# EAGLE design Power Distribution (EAGLE 6.5.0)
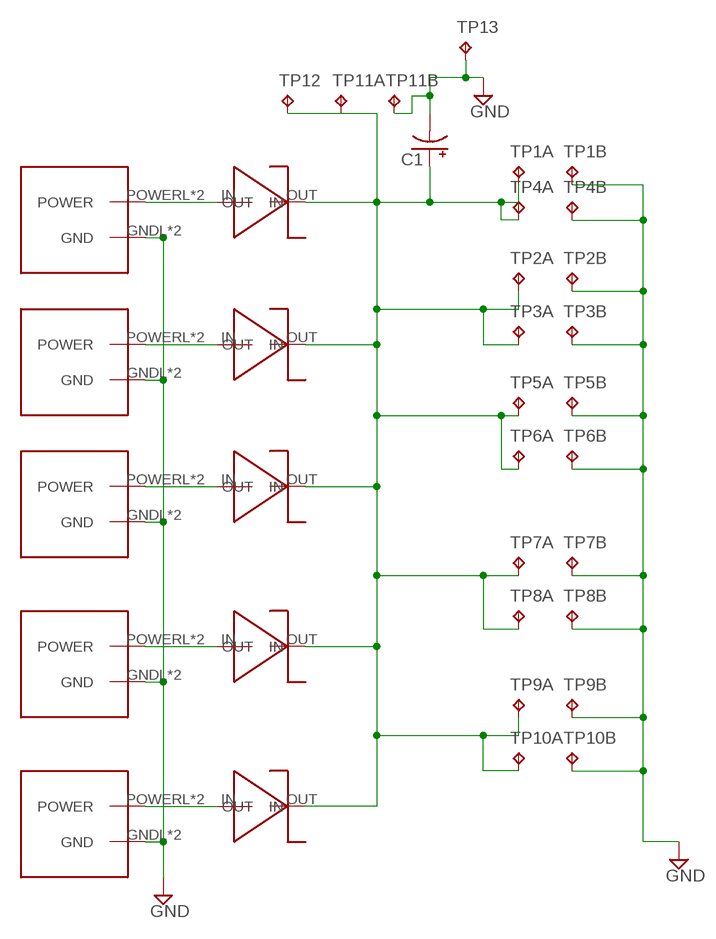
[diagram p0: schematic, sheet 1]

## Parts
C1  CPOL-USE2.5-6  [E2,5-6]
TP1  TP2P2-38-17  [P2-38-17]
TP2  TP2P2-38-17  [P2-38-17]
TP3  TP2P2-38-17  [P2-38-17]
TP4  TP2P2-38-17  [P2-38-17]
TP5  TP2P2-38-17  [P2-38-17]
TP6  TP2P2-38-17  [P2-38-17]
TP7  TP2P2-38-17  [P2-38-17]
TP8  TP2P2-38-17  [P2-38-17]
TP9  TP2P2-38-17  [P2-38-17]
TP10  TP2P2-38-17  [P2-38-17]
TP11  TP2P2-38-17  [P2-38-17]
TP12  TPTP20SQ  [TP20SQ]
TP13  TPTP20SQ  [TP20SQ]
U$1  2X2-MOLEX  [2X2MOLEX]
U$2  2X2-MOLEX  [2X2MOLEX]
U$3  2X2-MOLEX  [2X2MOLEX]
U$4  2X2-MOLEX  [2X2MOLEX]
U$5  2X2-MOLEX  [2X2MOLEX]
U$6  DO-214AB  [DO-214AB]
U$7  DO-214AB  [DO-214AB]
U$8  DO-214AB  [DO-214AB]
U$9  DO-214AB  [DO-214AB]
U$10  DO-214AB  [DO-214AB]

## Nets
GND: C1.- TP1.TP-2 TP2.TP-2 TP3.TP-2 TP4.TP-2 TP5.TP-2 TP6.TP-2 TP7.TP-2 TP8.TP-2 TP9.TP-2 TP10.TP-2 TP11.TP-2 TP13.TP U$1.GNDL(GND) U$1.GNDR(GND) U$2.GNDL(GND) U$2.GNDR(GND) U$3.GNDL(GND) U$3.GNDR(GND) U$4.GNDL(GND) U$4.GNDR(GND) U$5.GNDL(GND) U$5.GNDR(GND)
N$1: U$5.POWERL(POWER) U$5.POWERR(POWER) U$6.IN
N$2: U$1.POWERL(POWER) U$1.POWERR(POWER) U$7.IN
N$3: U$2.POWERL(POWER) U$2.POWERR(POWER) U$8.IN
N$4: U$3.POWERL(POWER) U$3.POWERR(POWER) U$9.IN
N$5: U$4.POWERL(POWER) U$4.POWERR(POWER) U$10.IN
N$6: C1.+ TP1.TP-1 TP2.TP-1 TP3.TP-1 TP4.TP-1 TP5.TP-1 TP6.TP-1 TP7.TP-1 TP8.TP-1 TP9.TP-1 TP10.TP-1 TP11.TP-1 TP12.TP U$6.OUT U$7.OUT U$8.OUT U$9.OUT U$10.OUT

## Library data of the parts
C1 = resistor:CPOL-US: POLARIZED CAPACITOR, American symbol
TP1-TP11 = testpad:TP2: Test pad
TP12 TP13 = testpad:TP: Test pad
U$1-U$5 = Molex:2X2-MOLEX
U$6-U$10 = Diodes:DO-214AB

## Board
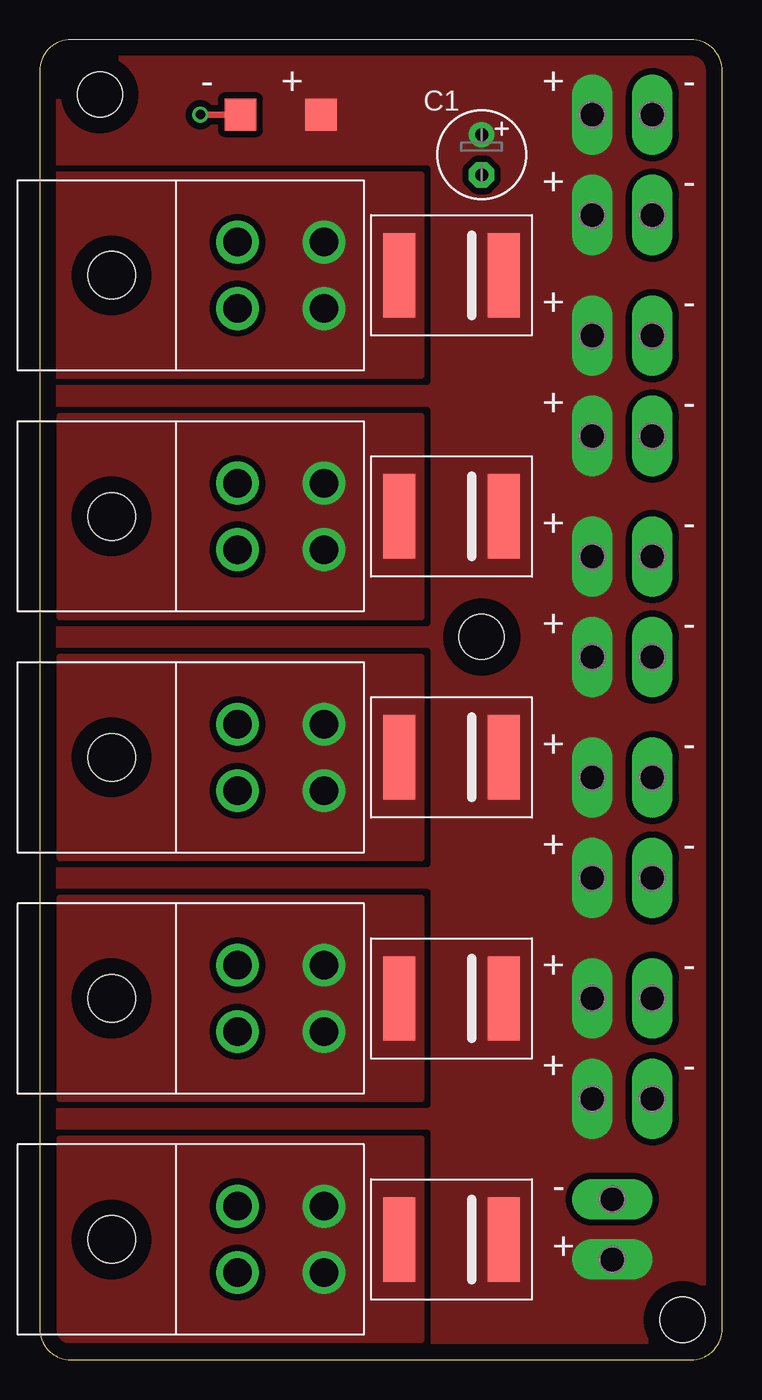
[diagram p1: board, top side]
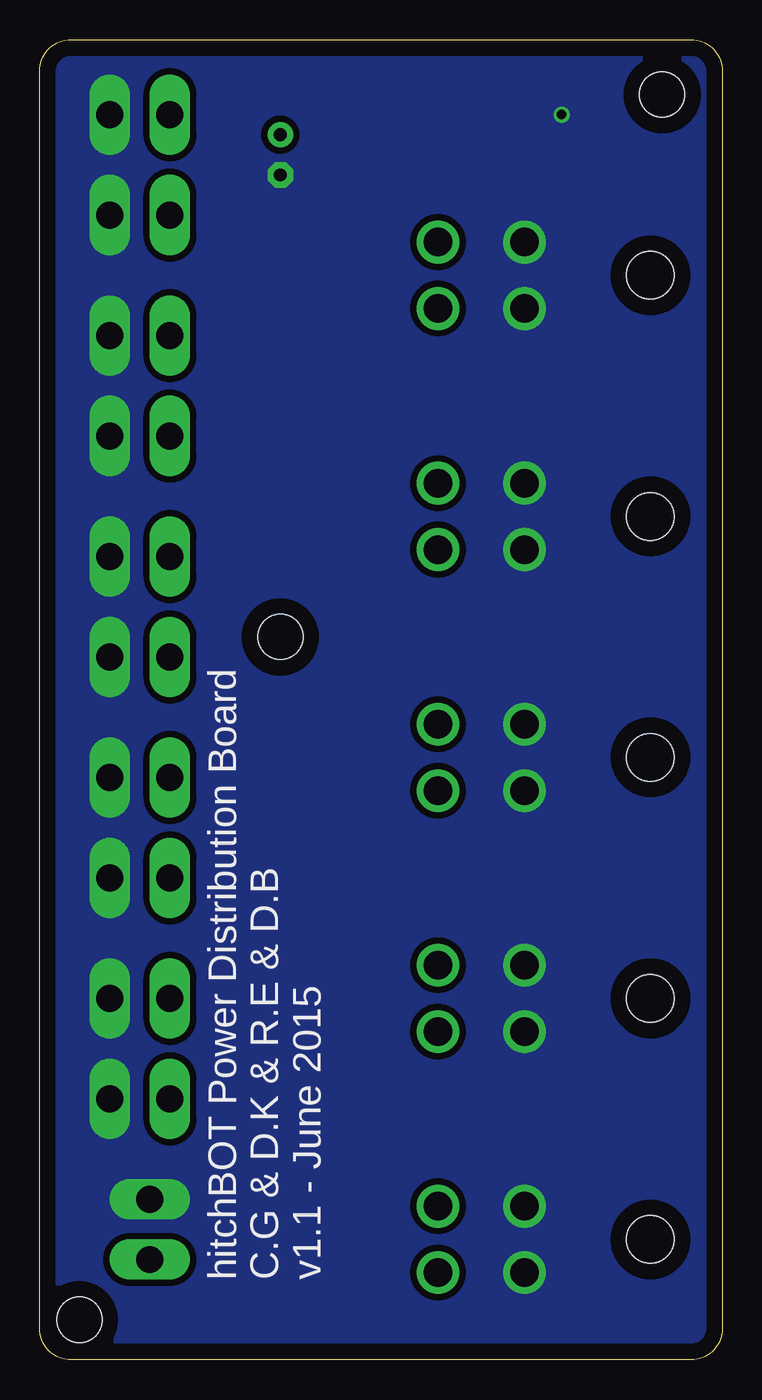
[diagram p2: board, bottom side, seen from below]

Size 43.16 x 83.49 mm. Coordinates in mm from the lower left corner, seen from the top.
Outline: 0,81.49 0,2 arc90 2,0 41.16,0 arc90 43.16,2 43.16,81.49 arc90 41.16,83.49 2,83.49 arc90 0,81.49
Copper layers (1*16): Top 0.035mm / dielectric 1.5mm / Bottom 0.035mm
Design rules "default": minimum track width 10mil, minimum drill 24mil, track to track 8mil, track to pad 8mil, pad to pad 8mil, via to via 8mil, smd to smd 8mil, copper to edge 40mil, drill to drill 8mil, minimum pad ring 10mil, minimum via ring 8mil, stop-mask expansion 4mil, vias tented up to drill 0mil, thermal gap 10mil
Holes 2.84 mm at 3.81,80.01 40.64,2.54 27.94,45.72

### Footprints (pad centres in the part's own frame; a part is rotated, then mirrored left to right if it is on the bottom)
E2,5-6 = drill 0.813 pad 1.6: + -1.27,0 | drill 0.813 pad 1.6 octagon: - 1.27,0
P2-38-17 = drill 1.702 pad 2.121 long: TP-1 -1.905,0; TP-2 1.905,0
TP20SQ = smd 2 x 2: TP 0,0
2X2MOLEX = drill 1.8: GNDL -2.1,-2.1; GNDR 2.1,-2.1; POWERL -2.1,3.37; POWERR 2.1,3.37 | hole 3: 0,-10.05
DO-214AB = smd 2.032 x 5.334: IN -3.302,0; OUT 3.302,0

### Placement (x,y rotation side)
C1  27.94,76.2 270 top
TP1  36.2,8.26 90 top
TP2  36.83,16.51 0 top
TP3  36.83,22.86 0 top
TP4  36.83,72.39 0 top
TP5  36.83,58.42 0 top
TP6  36.83,44.45 0 top
TP7  36.83,30.48 0 top
TP8  36.83,78.74 0 top
TP9  36.83,64.77 0 top
TP10  36.83,50.8 0 top
TP11  36.83,36.83 0 top
TP12  17.78,78.74 0 top
TP13  12.7,78.74 0 top
U$1  14.61,22.86 270 top
U$2  14.61,38.1 270 top
U$3  14.61,53.34 270 top
U$4  14.61,68.58 270 top
U$5  14.61,7.62 270 top
U$6  26.04,7.62 0 top
U$7  26.04,22.86 0 top
U$8  26.04,38.1 0 top
U$9  26.04,53.34 0 top
U$10  26.04,68.58 0 top

### Tracks (layer width: path | path; a pad name or v marks a point on that pad's centre or on a via)
GND  (via drill 0.6)
  Top 0.406: TP13.TP v10.16,78.74
  pour Bottom (isolate 0.406, no thermals): -1.27,84.45 44.45,84.45 44.45,-1.27 -1.27,-1.27
N$1
  pour Top (isolate 0.406, no thermals): 1.27,13.97 24.13,13.97 24.13,1.27 1.27,1.27
N$2
  pour Top (isolate 0.406, no thermals): 1.27,29.21 24.13,29.21 24.13,16.51 1.27,16.51
N$3
  pour Top (isolate 0.406, no thermals): 1.27,44.45 24.13,44.45 24.13,31.75 1.27,31.75
N$4
  pour Top (isolate 0.406, no thermals): 1.27,59.69 24.13,59.69 24.13,46.99 1.27,46.99
N$5
  pour Top (isolate 0.406, no thermals): 24.13,74.93 24.13,62.23 -1.27,62.23 -1.27,74.93
N$6
  pour Top (isolate 0.406, rank 2, no thermals): -1.27,84.45 44.45,84.45 44.45,-1.27 -1.27,-1.27

### Text on the board
tPlace: - | + | + | - | + | - | + | - | + | - | + | - | + | - | + | - | + | - | + | - | + | - | - | +
bPlace: hitchBOT Power Distribution Board / C.G & D.K & R.E & D.B / v1.1 - June 2015